# EAGLE design EncoderPCB_V1_3 (EAGLE 9.6.2)
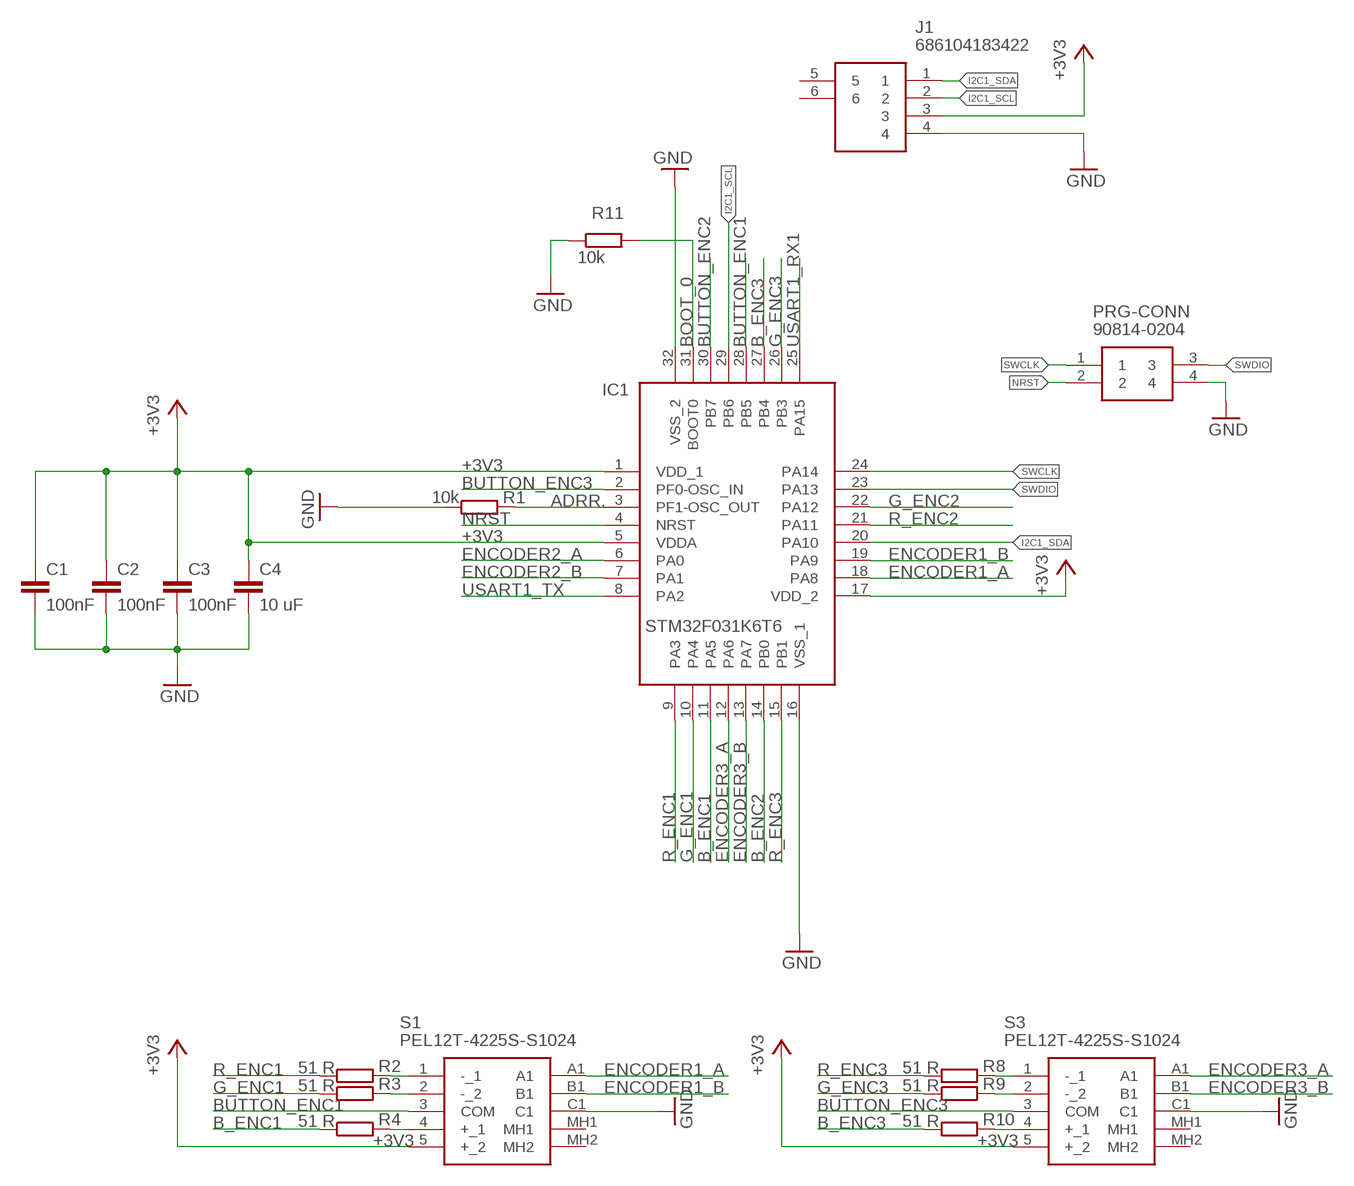
[diagram p0: schematic, sheet 1]

## Parts
C1  100nF  CAPACITOR"  [C0603]
C2  100nF  CAPACITOR"  [C0603]
C3  100nF  CAPACITOR"  [C0603]
C4  10 uF  CAPACITOR_1206  [C1206]
IC1  STM32F031K6T6  [QFP80P900X900X160-32N]
J1  686104183422  [686104183422]
PRG-CONN  90814-0204  [MOLEX_90814-0204]
R1  10k  RESISTOR_0603  [R0603]
R2  51 R  RESISTOR_0603  [R0603]
R3  51 R  RESISTOR_0603  [R0603]
R4  51 R  RESISTOR_0603  [R0603]
R8  51 R  RESISTOR_0603  [R0603]
R9  51 R  RESISTOR_0603  [R0603]
R10  51 R  RESISTOR_0603  [R0603]
R11  10k  RESISTOR_0603  [R0603]
S1  PEL12T-4225S-S1024  [PEL12T4225SS1024]
S3  PEL12T-4225S-S1024  [PEL12T4225SS1024]

## Nets
+3V3: C1.1 C2.1 C3.1 C4.1 IC1.1(VDD_1) IC1.5(VDDA) IC1.17(VDD_2) J1.3 S1.5(+_2) S3.5(+_2)
ADRR.: IC1.3(PF1-OSC_OUT) R1.2
B_ENC1: IC1.11(PA5) R4.1
B_ENC2: IC1.14(PB0)
B_ENC3: IC1.27(PB4) R10.1
BOOT_0: IC1.31(BOOT0) R11.2
BUTTON_ENC1: IC1.28(PB5) S1.3(COM)
BUTTON_ENC2: IC1.30(PB7)
BUTTON_ENC3: IC1.2(PF0-OSC_IN) S3.3(COM)
ENCODER1_A: IC1.18(PA8) S1.A1
ENCODER1_B: IC1.19(PA9) S1.B1
ENCODER2_A: IC1.6(PA0)
ENCODER2_B: IC1.7(PA1)
ENCODER3_A: IC1.12(PA6) S3.A1
ENCODER3_B: IC1.13(PA7) S3.B1
G_ENC1: IC1.10(PA4) R3.1
G_ENC2: IC1.22(PA12)
G_ENC3: IC1.26(PB3) R9.1
GND: C1.2 C2.2 C3.2 C4.2 IC1.16(VSS_1) IC1.32(VSS_2) J1.4 PRG-CONN.4 R1.1 R11.1 S1.C1 S3.C1
I2C1_SCL: IC1.29(PB6) J1.2
I2C1_SDA: IC1.20(PA10) J1.1
N$9: R2.2 S1.1(-_1)
N$10: R3.2 S1.2(-_2)
N$12: R4.2 S1.4(+_1)
N$15: R8.2 S3.1(-_1)
N$16: R9.2 S3.2(-_2)
N$17: R10.2 S3.4(+_1)
NRST: IC1.4(NRST) PRG-CONN.2
R_ENC1: IC1.9(PA3) R2.1
R_ENC2: IC1.21(PA11)
R_ENC3: IC1.15(PB1) R8.1
SWCLK: IC1.24(PA14) PRG-CONN.1
SWDIO: IC1.23(PA13) PRG-CONN.3
USART1_RX1: IC1.25(PA15)
USART1_TX: IC1.8(PA2)
Unconnected: J1.5 J1.6 S1.MH1 S1.MH2 S3.MH1 S3.MH2

## Library data of the parts
C1-C3 = C_Sager_Bibliothek:CAPACITOR: capacitor
C4 = passive components:CAPACITOR: ceramic capacitor
IC1 = C_Sager_Bibliothek:STM32F031K6T6: ARM Microcontrollers - MCU 16/32-BITS MICROS Source: Datasheet <https://componentsearchengine.com/Datasheets/1/STM32F031K6T6.pdf>; DESCRIPTION: ARM Microcontrollers - MCU 16/32-BITS MICROS; HEIGHT: 1.6mm; MANUFACTURER_NAME: STMicroelectronics; MANUFACTURER_PART_NUMBER: STM32F031K6T6; MOUSER_PART_NUMBER: 511-STM32F031K6T6; MOUSER_PRICE-STOCK: https://www.mouser.com/Search/Refine.aspx?Keyword=511-STM32F031K6T6
J1 = electro_mechanical:686104183422: Wurth Elektronik WR-FPC Series 1mm Pitch 4 Way Horizontal SMT Female FPC Connector, Top Contact Source: Datasheet <https://componentsearchengine.com/Datasheets/1/686104183422.pdf>; DESCRIPTION: Wurth Elektronik WR-FPC Series 1mm Pitch 4 Way Horizontal SMT Female FPC Connector, Top Contact; HEIGHT: 1.3mm; MANUFACTURER_NAME: Wurth Elektronik; MANUFACTURER_PART_NUMBER: 686104183422; MOUSER_PART_NUMBER: 710-686104183422; MOUSER_PRICE-STOCK: https://www.mouser.com/Search/Refine.aspx?Keyword=710-686104183422
PRG-CONN = electro_mechanical:90814-0204: CONN HEADER 4POS 1.27MM SMD TIN Source: Datasheet <https://componentsearchengine.com/Datasheets/1/90814-0204.pdf>; DESCRIPTION: CONN HEADER 4POS 1.27MM SMD TIN; HEIGHT: mm; MANUFACTURER_NAME: Molex; MANUFACTURER_PART_NUMBER: 90814-0204; MOUSER_PART_NUMBER: 538-90814-0204; MOUSER_PRICE-STOCK: https://www.mouser.com/Search/Refine.aspx?Keyword=538-90814-0204
R1-R4 R8-R11 = passive components:RESISTOR: +/- 5 % resistor
S1 S3 = electro_mechanical:PEL12T-4225S-S1024: Encoders Red Blue/Green LED Push Switch Knurled Source: Datasheet <https://componentsearchengine.com/Datasheets/1/PEL12T-4225S-S1024.pdf>; DESCRIPTION: Encoders Red Blue/Green LED Push Switch Knurled; HEIGHT: 25mm; MANUFACTURER_NAME: Bourns; MANUFACTURER_PART_NUMBER: PEL12T-4225S-S1024; MOUSER_PART_NUMBER: 652-PEL12T4225SS1024; MOUSER_PRICE-STOCK: https://www.mouser.com/Search/Refine.aspx?Keyword=652-PEL12T4225SS1024

## Board
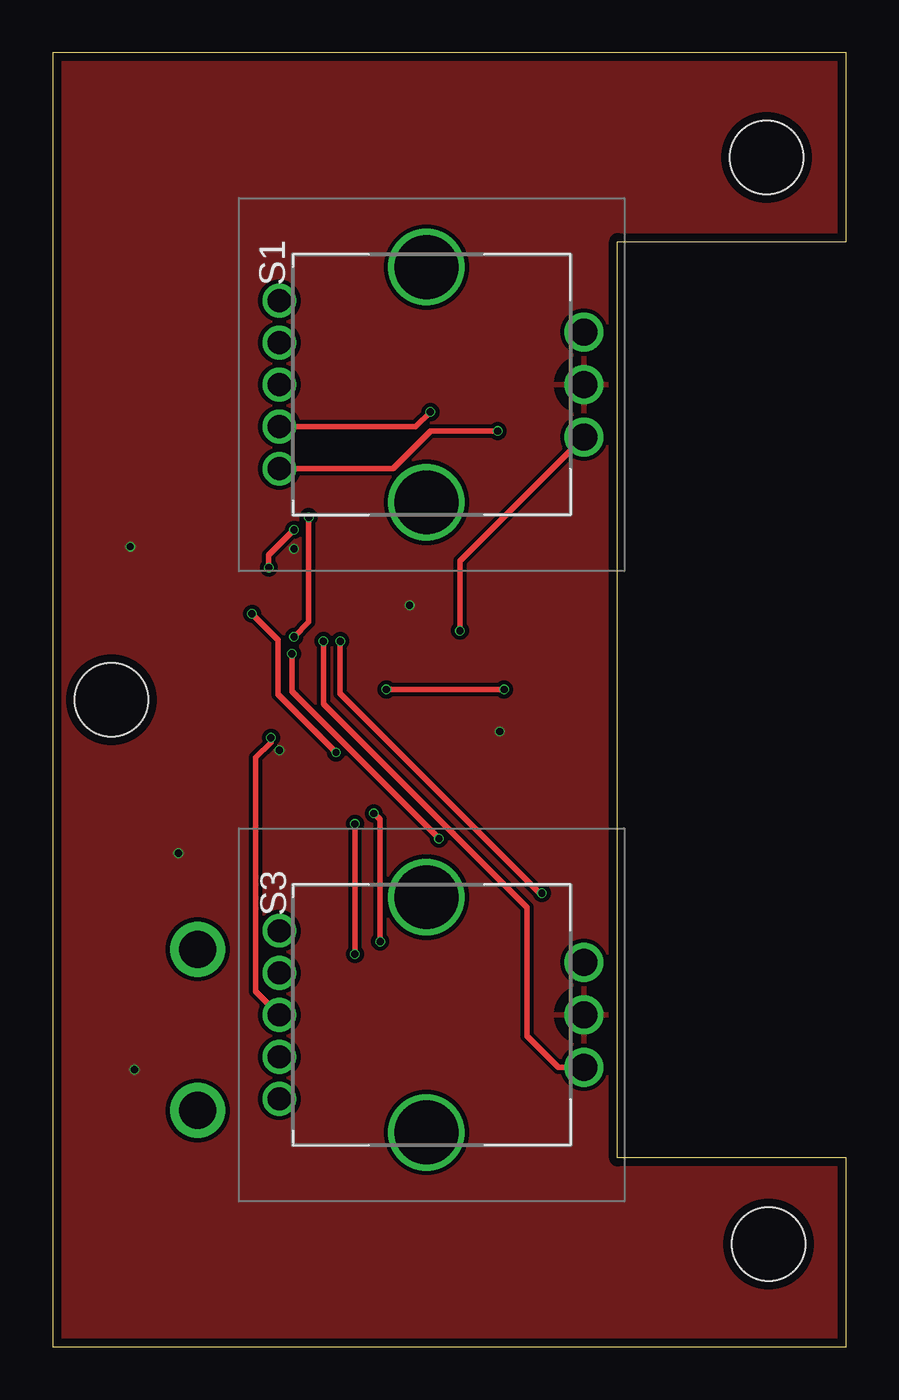
[diagram p1: board, top side]
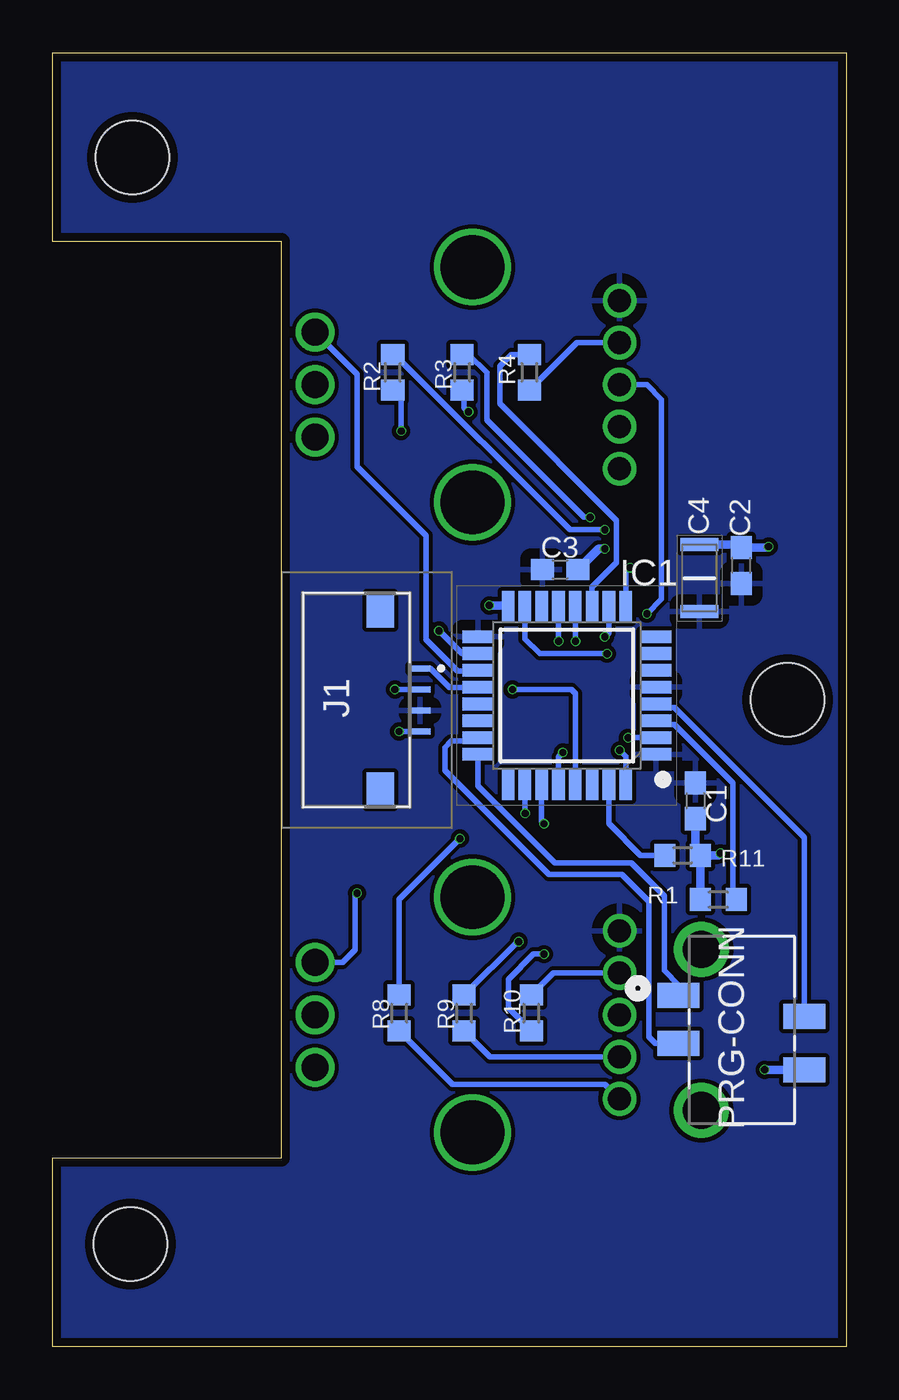
[diagram p2: board, bottom side, seen from below]

Size 37.8 x 61.62 mm. Coordinates in mm from the lower left corner, seen from the top.
Outline: 0,0 37.8,0 37.8,9 26.9,9 26.9,52.62 37.8,52.62 37.8,61.62 0,61.62 0,0
Copper layers (1*16): Top(GND) 0.035mm / dielectric 1.5mm / Bottom(+3V3) 0.035mm
Design rules "aisler_go_2layer *": minimum track width 0.1mm, minimum drill 0.2mm, track to track 0.2mm, track to pad 0.2mm, pad to pad 0.2mm, via to via 0.2mm, smd to smd 0.2mm, copper to edge 0.4mm, drill to drill 0.21mm, minimum pad ring 0.25mm, minimum via ring 0.05mm, stop-mask expansion 0.01mm, vias tented up to drill 0mil, thermal gap 20mil
Holes 3.5 mm at 34.09,4.9 2.8,30.81 33.99,56.62

### Footprints (pad centres in the part's own frame; a part is rotated, then mirrored left to right if it is on the bottom)
C0603 = smd 1.1 x 1: 1 -0.85,0; 2 0.85,0
C1206 = smd 0.62 x 1.82: 1 -1.6,0; 2 1.6,0
QFP80P900X900X160-32N = smd 1.475 x 0.6: 1 -4.238,2.8; 2 -4.238,2; 3 -4.238,1.2; 4 -4.238,0.4; 5 -4.238,-0.4; 6 -4.238,-1.2; 7 -4.238,-2; 8 -4.238,-2.8; 17 4.238,-2.8; 18 4.238,-2; 19 4.238,-1.2; 20 4.238,-0.4; 21 4.238,0.4; 22 4.238,1.2; 23 4.238,2; 24 4.238,2.8 | smd 0.6 x 1.475: 9 -2.8,-4.238; 10 -2,-4.238; 11 -1.2,-4.238; 12 -0.4,-4.238; 13 0.4,-4.238; 14 1.2,-4.238; 15 2,-4.238; 16 2.8,-4.238; 25 2.8,4.238; 26 2,4.238; 27 1.2,4.238; 28 0.4,4.238; 29 -0.4,4.238; 30 -1.2,4.238; 31 -2,4.238; 32 -2.8,4.238
686104183422 = smd 0.3 x 1: 1 -1.5,1.9; 2 -0.5,1.9; 3 0.5,1.9; 4 1.5,1.9 | smd 1.65 x 1.3: 5 -4.275,0; 6 4.275,0
MOLEX_90814-0204 = smd 1.194 x 2.007: 1 0.254,0; 2 1.27,5.994; 3 2.54,0; 4 3.81,5.994 | drill 1.753 pad 2.629: 5 -1.93,1.092; 6 5.74,1.092
R0603 = smd 1 x 1.1: 1 -0.85,0; 2 0.85,0
PEL12T4225SS1024 = drill 1.1 pad 1.6: 1 -4,7; 2 -2,7; 3 0,7; 4 2,7; 5 4,7 | drill 1.3 pad 1.85: A1 -2.5,-7.5; B1 2.5,-7.5; C1 0,-7.5 | drill 3.041 pad 3.175: MH1 -5.6,0; MH2 5.6,0

### Placement (x,y rotation side)
C1  7.2,26 270 bottom
C2  5,37.2 90 bottom
C3  13.63,37.01 0 bottom
C4  7,36.6 90 bottom
IC1  13.31,31.01 180 bottom
J1  22.2,30.8 270 bottom
PRG-CONN  8,17 270 bottom
R1  6.1,21.3 0 bottom
R2  21.6,46.4 270 bottom
R3  18.3,46.4 270 bottom
R4  15.1,46.4 270 bottom
R8  21.3,15.9 270 bottom
R9  18.2,15.9 270 bottom
R10  15,15.9 90 bottom
R11  7.8,23.4 180 bottom
S1  17.8,45.81 90 top
S3  17.8,15.81 90 top

### Tracks (layer width: path | path; a pad name or v marks a point on that pad's centre or on a via)
+3V3
  pour Bottom(+3V3): 39.3,66.5 39.3,-2.9 -3.8,-2.9 -3.8,66.5
ADRR.
  Bottom(+3V3) 0.254: IC1.3 8.9,29.64 8.2,29.64 5.4,26.84 5.4,21.45 R1.2
B_ENC1
  Bottom(+3V3) 0.254: R4.1 15.95,47.25 16.5,46.7 16.5,44.9 10.95,39.35 10.95,37.33 12.11,36.17 IC1.11
B_ENC3  (via drill 0.35)
  Top(GND) 0.254: v14.4,24.9 v14.4,18.7
  Bottom(+3V3) 0.254: R10.1 16.1,16.15 16.1,17.5 14.9,18.7 v14.4,18.7 | v14.4,24.9 14.51,25.01 IC1.27
BOOT_0
  Bottom(+3V3) 0.254: R11.2 9.8,23.4 11.31,24.91 IC1.31
BUTTON_ENC1  (via drill 0.35)
  Top(GND) 0.254: v9.5,34.9 10.75,33.65 10.75,31.05 v13.5,28.3
  Bottom(+3V3) 0.254: S1.3 9.51,45.81 8.8,45.1 8.8,35.6 v9.5,34.9 | v13.5,28.3 13.71,28.09 IC1.28
BUTTON_ENC3  (via drill 0.35)
  Top(GND) 0.254: v10.4,29 10.4,28.78 9.67,28.05 9.67,16.94 S3.3
  Bottom(+3V3) 0.254: IC1.2 v10.39,29.01 v10.4,29
ENCODER1_A  (via drill 0.35)
  Top(GND) 0.254: S1.A1 19.4,37.41 v19.4,34.1
  Bottom(+3V3) 0.254: v19.4,34.1 18.31,33.01 IC1.18
ENCODER1_B
  Bottom(+3V3) 0.254: S1.B1 23.3,46.31 23.3,41.91 20.01,38.62 20.01,33.67 18.52,32.18 17.57,32.18 IC1.19
ENCODER3_A  (via drill 0.35)
  Top(GND) 0.254: v12.9,33.6 12.9,30.62 22.6,20.92 22.6,14.8 24.09,13.31 S3.A1
  Bottom(+3V3) 0.254: IC1.12 v12.91,33.61 v12.9,33.6
ENCODER3_B  (via drill 0.35)
  Top(GND) 0.254: v13.7,33.6 13.7,31.1 23.2,21.6 v23.3,21.6
  Bottom(+3V3) 0.254: v13.7,33.6 13.7,35.24 IC1.13 | v23.3,21.6 23.4,21.5 23.4,18.9 23.99,18.31 S3.B1
G_ENC1  (via drill 0.35)
  Top(GND) 0.254: v12.2,39.5 12.2,34.5 v11.5,33.8
  Bottom(+3V3) 0.254: v12.2,39.5 12.5,39.5 17.12,44.12 17.12,46.38 17.99,47.25 R3.1 | v11.5,33.8 11.31,33.99 IC1.10
G_ENC3  (via drill 0.35)
  Top(GND) 0.254: v15.6,19.3 15.6,25.1 v15.3,25.4
  Bottom(+3V3) 0.254: R9.1 15.65,19.3 v15.6,19.3 | v15.3,25.4 IC1.26
GND  (via drill 0.35)
  Bottom(+3V3) 0.254: J1.4 v21.3,29.3 | IC1.32 10.51,28.11 v10.8,28.4
  Bottom(+3V3) 0.406: C4.2 5.15,38.2 C2.2 3.75,38.05 v3.7,38.1 | C3.2 11.79,38 v11.5,38 | IC1.16 16.16,35.3 v17,35.3 | C1.2 7.2,23.65 R11.1 | R11.1 6.1,23.4 v6,23.5 | PRG-CONN.4 v3.89,13.19 v3.9,13.2 | R1.1 R11.1
  pour Top(GND): 38.4,64.7 38.4,-1.5 -2.1,-1.5 -2.1,64.7
I2C1_SCL  (via drill 0.35)
  Top(GND) 0.254: v21.5,31.3 v15.9,31.3
  Bottom(+3V3) 0.254: J1.2 v21.5,31.3 | v15.9,31.3 13.1,31.3 12.9,31.1 12.9,26.78 IC1.29
I2C1_SDA
  Bottom(+3V3) 0.254: J1.1 19.8,32.3 18.9,31.4 IC1.20
N$9  (via drill 0.35)
  Top(GND) 0.254: S1.1 16.21,41.81 18,43.6 v21.2,43.6
  Bottom(+3V3) 0.254: v21.2,43.6 21.2,45.15 R2.2
N$10  (via drill 0.35)
  Top(GND) 0.254: S1.2 17.29,43.81 v17.99,44.51
  Bottom(+3V3) 0.254: v17.99,44.51 18.2,44.72 18.2,45.45 R3.2
N$12
  Bottom(+3V3) 0.254: R4.2 12.84,47.81 S1.4
N$15
  Bottom(+3V3) 0.254: R8.2 18.75,12.5 11.49,12.5 S3.1
N$16
  Bottom(+3V3) 0.254: R9.2 16.96,13.81 S3.2
N$17
  Bottom(+3V3) 0.254: R10.2 13.94,17.81 S3.4
NRST
  Bottom(+3V3) 0.254: IC1.4 8.9,30.44 8.2,30.44 2.01,24.24 PRG-CONN.2
R_ENC1  (via drill 0.35)
  Top(GND) 0.254: v11.5,38.9 10.3,37.7 v10.3,37.1
  Bottom(+3V3) 0.254: R2.1 21.51,47.25 13.16,38.9 v11.5,38.9 | v10.3,37.1 10.5,36.9 IC1.9
R_ENC3  (via drill 0.35)
  Top(GND) 0.254: v18.4,24.2 11.4,31.2 v11.4,33
  Bottom(+3V3) 0.254: R8.1 21.3,21.3 v18.4,24.2 | v11.4,33 14.6,33 15.31,33.71 IC1.15
SWCLK
  Bottom(+3V3) 0.254: PRG-CONN.1 8,17.25 8.67,17.92 8.67,21.48 10.23,23.04 13.88,23.04 17.55,26.71 IC1.24
SWDIO
  Bottom(+3V3) 0.254: PRG-CONN.3 9.1,14.46 9.4,14.76 9.4,21.2 10.68,22.48 14.16,22.48 19.11,27.43 19.11,28.55 18.82,28.84 17.72,28.84 IC1.23